# EAGLE design Header (EAGLE 6.5.0)
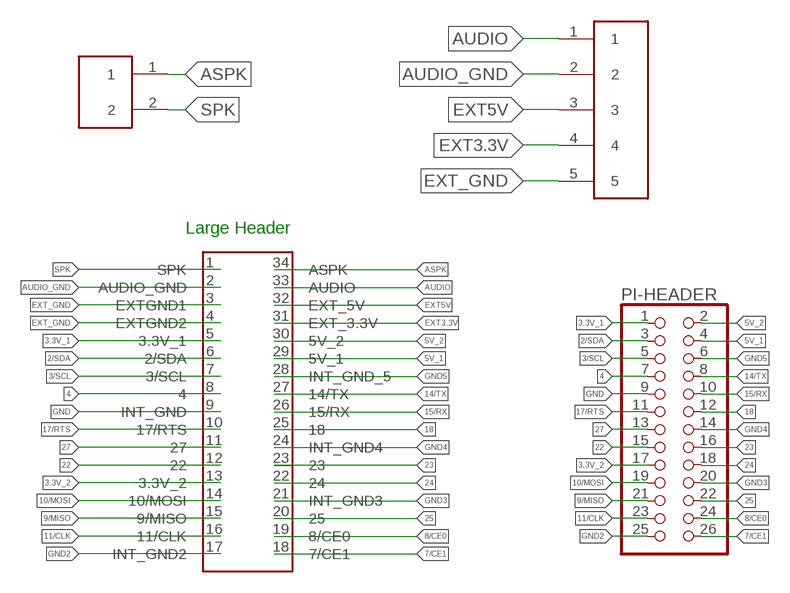
[diagram p0: schematic, sheet 1]

## Parts
PI-HEADER  PINHD-2X13  [2X13]
U$1  2X17HEADER  [2X32HEADER]
U$2  DF3_1X5  [DF3_1X5]
U$4  DF3_1X2  [DF3_1X2]

## Nets
2/SDA: PI-HEADER.3 U$1.6(2/SDA)
3.3V_1: PI-HEADER.1 U$1.5(3.3V_1)
3.3V_2: PI-HEADER.17 U$1.13(3.3V_2)
3/SCL: PI-HEADER.5 U$1.7(3/SCL)
4: PI-HEADER.7 U$1.8
5V_1: PI-HEADER.4 U$1.29(5V_1)
5V_2: PI-HEADER.2 U$1.30(5V_2)
7/CE1: PI-HEADER.26 U$1.18(7/CE1)
8/CE0: PI-HEADER.24 U$1.19(8/CE0)
9/MISO: PI-HEADER.21 U$1.15(9/MISO)
10/MOSI: PI-HEADER.19 U$1.14(10/MOSI)
11/CLK: PI-HEADER.23 U$1.16(11/CLK)
14/TX: PI-HEADER.8 U$1.27(14/TX)
15/RX: PI-HEADER.10 U$1.26(15/RX)
17/RTS: PI-HEADER.11 U$1.10(17/RTS)
18: PI-HEADER.12 U$1.25
22: PI-HEADER.15 U$1.12
23: PI-HEADER.16 U$1.23
24: PI-HEADER.18 U$1.22
25: PI-HEADER.22 U$1.20
27: PI-HEADER.13 U$1.11
ASPK: U$1.34(ASPK) U$4.1
AUDIO: U$1.33(AUDIO) U$2.1
AUDIO_GND: U$1.2(AUDIO_GND) U$2.2
EXT3.3V: U$1.31(EXT_3.3V) U$2.4
EXT5V: U$1.32(EXT_5V) U$2.3
EXT_GND: U$1.3(EXTGND1) U$1.4(EXTGND2) U$2.5
GND: PI-HEADER.9 U$1.9(INT_GND)
GND2: PI-HEADER.25 U$1.17(INT_GND2)
GND3: PI-HEADER.20 U$1.21(INT_GND3)
GND4: PI-HEADER.14 U$1.24(INT_GND4)
GND5: PI-HEADER.6 U$1.28(INT_GND_5)
SPK: U$1.1(SPK) U$4.2

## Notes on the sheet
- Large Header

## Library data of the parts
PI-HEADER = pinhead:PINHD-2X13: PIN HEADER
U$1 = ScottSilver:2X17HEADER
U$2 = ScottSilver:DF3_1X5
U$4 = ScottSilver:DF3_1X2

## Board
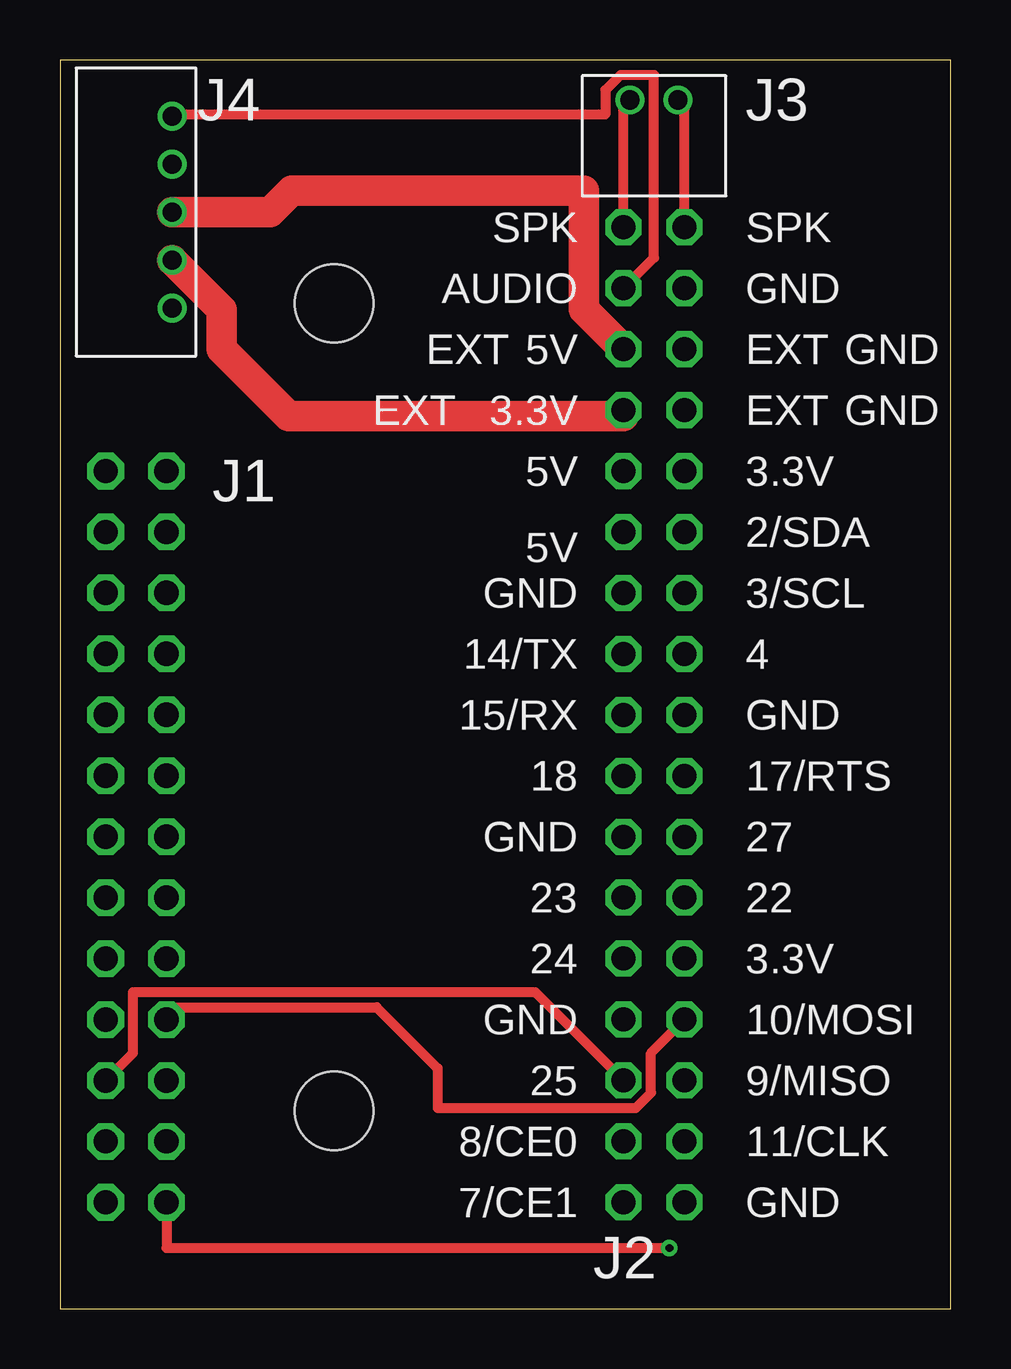
[diagram p1: board, top side]
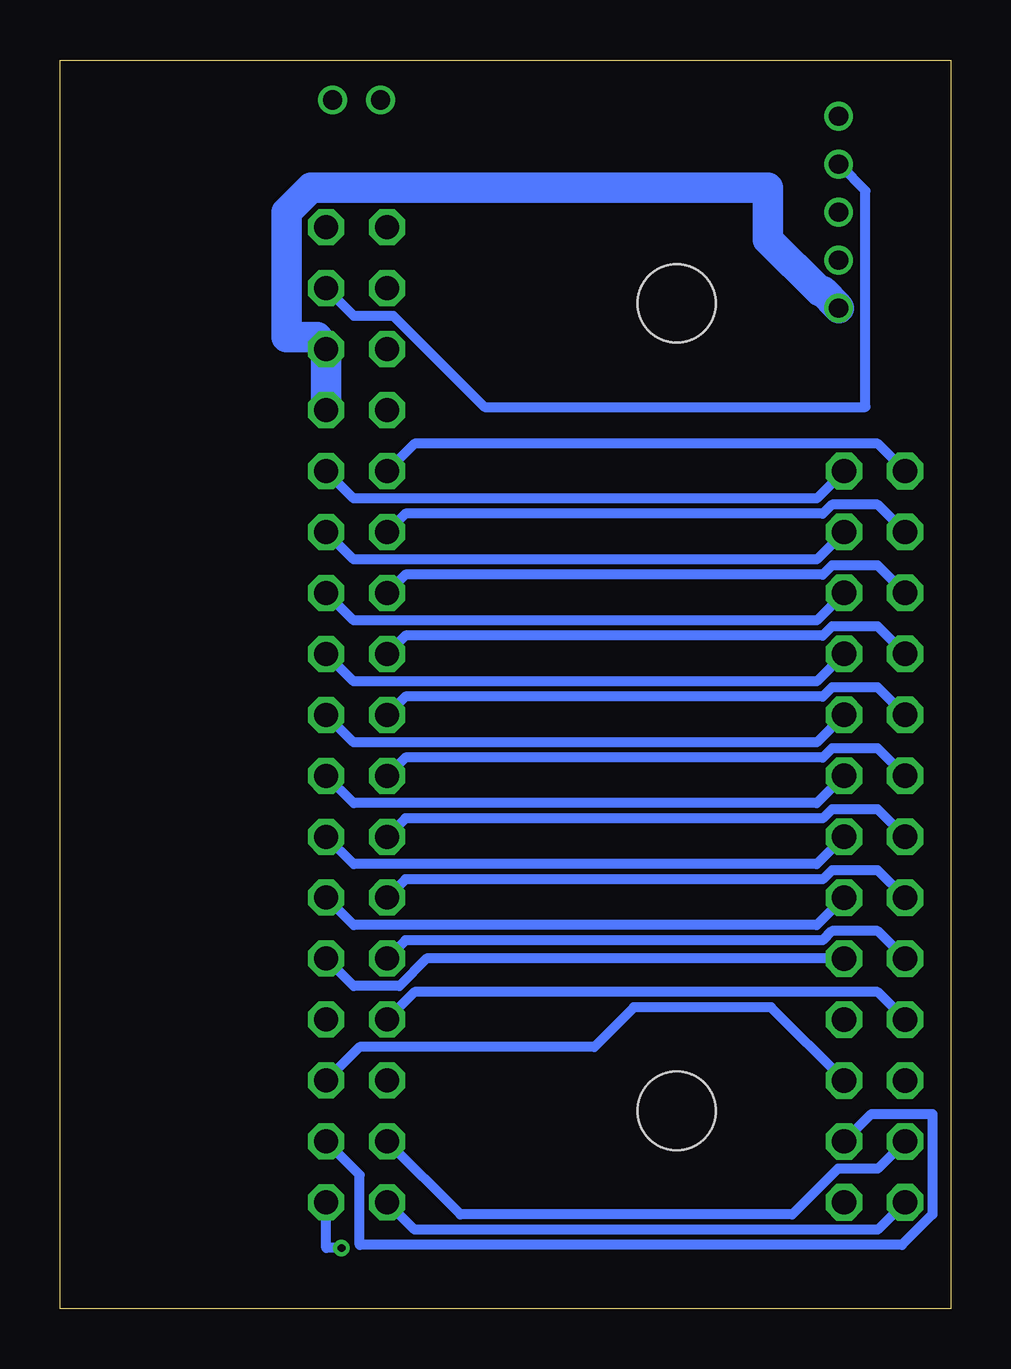
[diagram p2: board, bottom side, seen from below]

Size 37.13 x 52.06 mm. Coordinates in mm from the lower left corner, seen from the top.
Outline: 0,0 37.13,0 37.13,52.06 0,52.06 0,0
Copper layers (1*16): Top 0.0356mm / dielectric 1.5011mm / Bottom 0.0356mm
Design rules "LaenPCBOrder *": minimum track width 16mil, minimum drill 13mil, track to track 6mil, track to pad 6mil, pad to pad 6mil, via to via 6mil, smd to smd 6mil, copper to edge 15mil, drill to drill 6mil, minimum pad ring 7mil, minimum via ring 7mil, stop-mask expansion 3mil, vias tented up to drill 0mil, thermal gap 10mil
Holes 3.26 mm at 11.43,8.26 11.43,41.91
tRestrict: area 7.6,38.1 to 15.2,45.7; area 7.6,4.4 to 15.2,12.1
bRestrict: area 7.6,4.4 to 15.2,12.1; area 7.6,38.1 to 15.2,45.7

### Footprints (pad centres in the part's own frame; a part is rotated, then mirrored left to right if it is on the bottom)
2X13 = drill 1.016 octagon: 1 -15.24,-1.27; 2 -15.24,1.27; 3 -12.7,-1.27; 4 -12.7,1.27; 5 -10.16,-1.27; 6 -10.16,1.27; 7 -7.62,-1.27; 8 -7.62,1.27; 9 -5.08,-1.27; 10 -5.08,1.27; 11 -2.54,-1.27; 12 -2.54,1.27; 13 0,-1.27; 14 0,1.27; 15 2.54,-1.27; 16 2.54,1.27; 17 5.08,-1.27; 18 5.08,1.27; 19 7.62,-1.27; 20 7.62,1.27; 21 10.16,-1.27; 22 10.16,1.27; 23 12.7,-1.27; 24 12.7,1.27; 25 15.24,-1.27; 26 15.24,1.27
2X32HEADER = drill 1 octagon: 1 -20.32,-1.27; 2 -17.78,-1.27; 3 -15.24,-1.27; 4 -12.7,-1.27; 5 -10.16,-1.27; 6 -7.62,-1.27; 7 -5.08,-1.27; 8 -2.54,-1.27; 9 0,-1.27; 10 2.54,-1.27; 11 5.08,-1.27; 12 7.62,-1.27; 13 10.16,-1.27; 14 12.7,-1.27; 15 15.24,-1.27; 16 17.78,-1.27; 17 20.32,-1.27; 18 20.32,1.27; 19 17.78,1.27; 20 15.24,1.27; 21 12.7,1.27; 22 10.16,1.27; 23 7.62,1.27; 24 5.08,1.27; 25 2.54,1.27; 26 0,1.27; 27 -2.54,1.27; 28 -5.08,1.27; 29 -7.62,1.27; 30 -10.16,1.27; 31 -12.7,1.27; 32 -15.24,1.27; 33 -17.78,1.27; 34 -20.32,1.27
DF3_1X5 = drill 0.8: 1 -4,-1.5; 2 -2,-1.5; 3 0,-1.5; 4 2,-1.5; 5 4,-1.5
DF3_1X2 = drill 0.8: 1 -1,-1.5; 2 1,-1.5

### Placement (x,y rotation side)
PI-HEADER  3.17,19.68 270 bottom
U$1  24.77,24.77 270 bottom
U$2  3.17,45.72 270 bottom
U$4  24.77,48.9 180 bottom

### Tracks (layer width: path | path; a pad name or v marks a point on that pad's centre or on a via)
2/SDA
  Bottom 0.406: U$1.6 24.89,31.24 5.59,31.24 PI-HEADER.3
3.3V_1
  Bottom 0.406: U$1.5 24.89,33.78 5.59,33.78 PI-HEADER.1
3.3V_2
  Bottom 0.406: U$1.13 24.89,13.46 22.99,13.46 21.84,14.61 PI-HEADER.17
3/SCL
  Bottom 0.406: U$1.7 24.89,28.7 5.59,28.7 PI-HEADER.5
4
  Bottom 0.406: U$1.8 24.89,26.16 5.59,26.16 PI-HEADER.7
5V_1
  Bottom 0.406: U$1.29 22.73,33.15 5.33,33.15 4.95,33.53 3.05,33.53 PI-HEADER.4
5V_2
  Bottom 0.406: U$1.30 22.35,36.07 3.05,36.07 PI-HEADER.2
7/CE1
  Bottom 0.406: U$1.18 22.35,3.3 3.05,3.3 PI-HEADER.26
8/CE0
  Bottom 0.406: U$1.19 20.45,3.94 6.6,3.94 4.7,5.84 3.05,5.84 PI-HEADER.24
9/MISO
  Bottom 0.406: U$1.15 24.64,10.92 14.86,10.92 13.21,12.57 7.49,12.57 PI-HEADER.21
10/MOSI
  Top 0.406: U$1.14 24.64,10.67 24.64,9.02 24,8.38 15.75,8.38 15.75,10.03 13.21,12.57 4.45,12.57 PI-HEADER.19
11/CLK
  Bottom 0.406: U$1.16 24.64,5.59 24.64,2.67 2.03,2.67 0.76,3.94 0.76,8.13 3.3,8.13 PI-HEADER.23
14/TX
  Bottom 0.406: U$1.27 22.73,28.07 5.33,28.07 4.95,28.45 3.05,28.45 PI-HEADER.8
15/RX
  Bottom 0.406: U$1.26 22.73,25.53 5.33,25.53 4.95,25.91 3.05,25.91 PI-HEADER.10
17/RTS
  Bottom 0.406: U$1.10 24.89,21.08 5.59,21.08 PI-HEADER.11
18
  Bottom 0.406: U$1.25 22.73,22.99 5.33,22.99 4.95,23.37 3.05,23.37 PI-HEADER.12
22
  Bottom 0.406: U$1.12 24.89,16 5.59,16 PI-HEADER.15
23
  Bottom 0.406: U$1.23 22.73,17.91 5.33,17.91 4.95,18.29 3.05,18.29 PI-HEADER.16
24
  Bottom 0.406: U$1.22 22.73,15.37 5.33,15.37 4.95,15.75 3.05,15.75 PI-HEADER.18
25
  Top 0.406: U$1.20 19.81,13.21 3.05,13.21 3.05,10.67 PI-HEADER.22
27
  Bottom 0.406: U$1.11 24.89,18.54 5.59,18.54 PI-HEADER.13
ASPK
  Top 0.406: U$1.34 23.5,50.04 23.75,50.29 U$4.1
AUDIO
  Top 0.406: U$1.33 24.77,43.81 24.77,51.44 23.37,51.44 22.73,50.8 22.73,49.78 4.7,49.78 U$2.1
AUDIO_GND
  Bottom 0.406: U$1.2 24.89,41.4 23.24,41.4 19.43,37.59 3.56,37.59 3.56,46.61 4.57,47.62 U$2.2
EXT3.3V
  Top 1.27: U$1.31 23.5,37.21 9.53,37.21 6.73,40.01 6.73,41.66 4.7,43.69 U$2.4
EXT5V
  Top 1.27: U$2.3 8.76,45.72 9.65,46.61 21.84,46.61 21.84,41.66 U$1.32
EXT_GND
  Bottom 1.27: U$1.4 U$1.3 26.42,40.51 27.69,40.51 27.69,45.72 26.67,46.74 7.62,46.74 7.62,44.58 5.46,42.42 5.33,42.42 4.7,41.78 U$2.5
GND
  Bottom 0.406: U$1.9 24.89,23.62 5.59,23.62 PI-HEADER.9
GND2  (via drill 0.33)
  Top 0.406: v25.4,2.54 4.45,2.54 PI-HEADER.25
  Bottom 0.406: U$1.17 26.04,2.54 v25.4,2.54
GND3
  Bottom 0.406: U$1.21 22.35,13.21 3.05,13.21 PI-HEADER.20
GND4
  Bottom 0.406: U$1.24 22.73,20.45 5.33,20.45 4.95,20.83 3.05,20.83 PI-HEADER.14
GND5
  Bottom 0.406: U$1.28 22.73,30.61 5.33,30.61 4.95,30.99 3.05,30.99 PI-HEADER.6
SPK
  Top 0.406: U$1.1 26.04,50.04 25.78,50.29 U$4.2

### Text on the board
tPlace: J4 | J3 | SPK | SPK | AUDIO | GND | EXT | 5V | EXT | GND | EXT | 3.3V | EXT | GND | 5V | J1 | 3.3V | 5V | 2/SDA | GND | 3/SCL | 14/TX | 4 | 15/RX | GND | 18 | 17/RTS | GND | 27 | 23 | 22 | 24 | 3.3V | GND | 10/MOSI | 25 | 9/MISO | 8/CE0 | 11/CLK | 7/CE1 | GND | J2
Reference: NOTES: / The double circles are on the reference layer and / will not be printed on the PCB